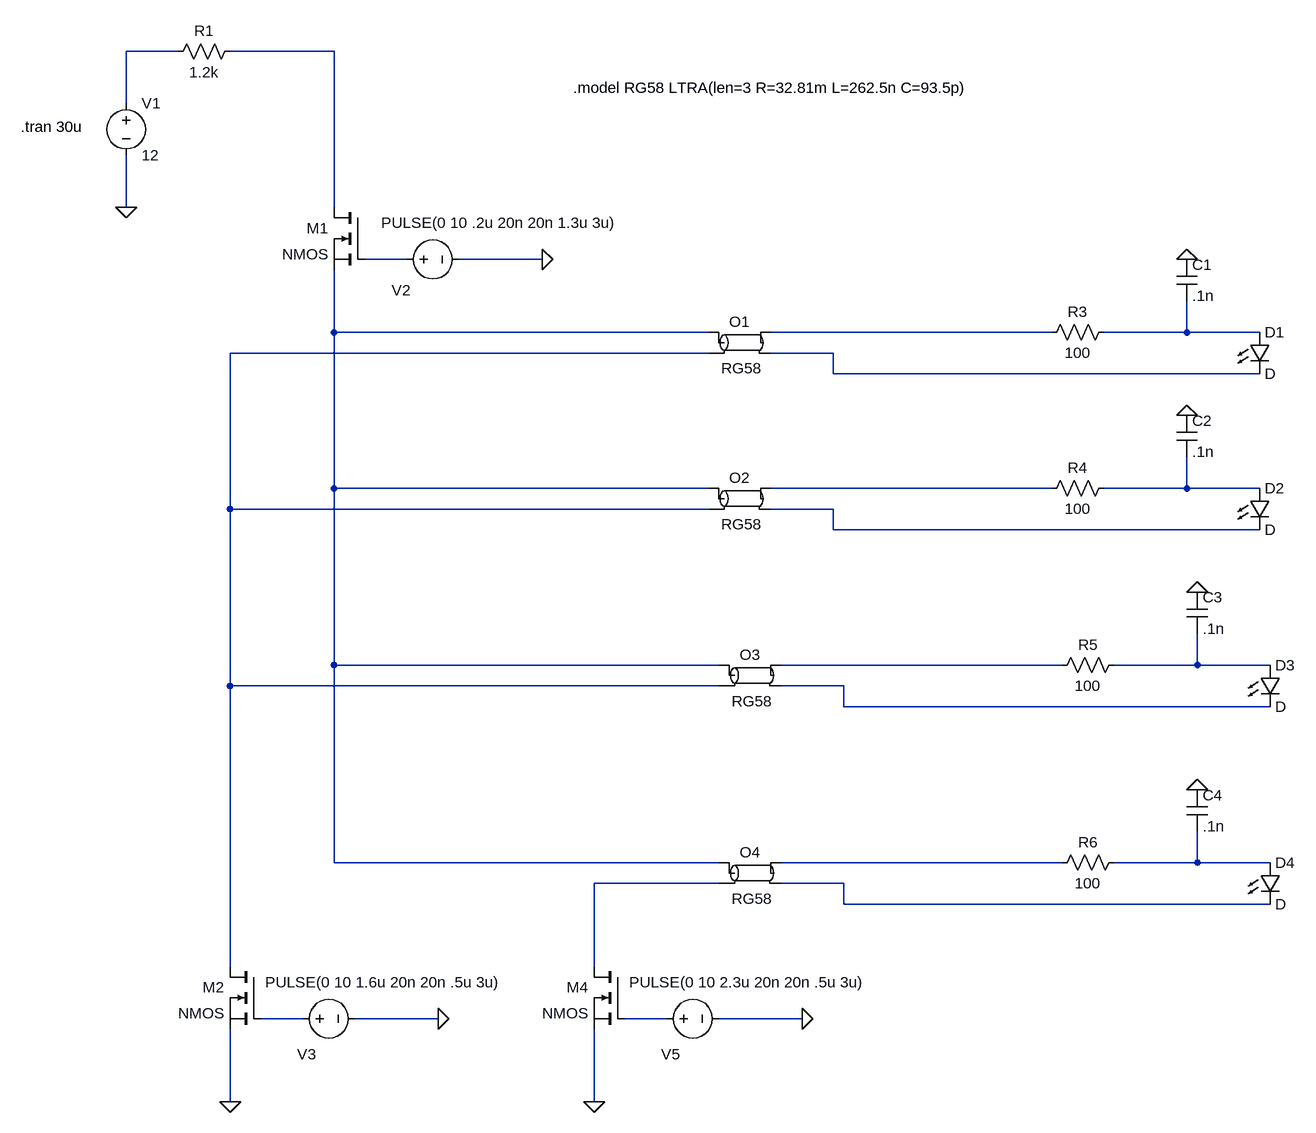
[diagram p0: schematic LEDpulser4_FULL_RG58.asc]
LEDpulser4_FULL_RG58.asc, the LTspice schematic file:
Version 4
SHEET 1 956 1444
WIRE -784 -288 -864 -288
WIRE -544 -288 -704 -288
WIRE -864 -208 -864 -288
WIRE -864 -48 -864 -128
WIRE -544 -48 -544 -288
WIRE -432 32 -496 32
WIRE -224 32 -352 32
WIRE -544 144 -544 48
WIRE 32 144 -544 144
WIRE 560 144 128 144
WIRE 768 144 768 96
WIRE 768 144 640 144
WIRE 880 144 768 144
WIRE 32 176 -704 176
WIRE 224 176 128 176
WIRE 224 208 224 176
WIRE 880 208 224 208
WIRE -544 384 -544 144
WIRE 32 384 -544 384
WIRE 560 384 128 384
WIRE 768 384 768 336
WIRE 768 384 640 384
WIRE 880 384 768 384
WIRE -704 416 -704 176
WIRE 32 416 -704 416
WIRE 224 416 128 416
WIRE 224 448 224 416
WIRE 880 448 224 448
WIRE -544 656 -544 384
WIRE 48 656 -544 656
WIRE 576 656 144 656
WIRE 784 656 784 608
WIRE 784 656 656 656
WIRE 896 656 784 656
WIRE -704 688 -704 416
WIRE 48 688 -704 688
WIRE 240 688 144 688
WIRE 240 720 240 688
WIRE 896 720 240 720
WIRE -544 960 -544 656
WIRE 48 960 -544 960
WIRE 576 960 144 960
WIRE 784 960 784 912
WIRE 784 960 656 960
WIRE 896 960 784 960
WIRE 48 992 -144 992
WIRE 240 992 144 992
WIRE 240 1024 240 992
WIRE 896 1024 240 1024
WIRE -704 1120 -704 688
WIRE -144 1120 -144 992
WIRE -592 1200 -656 1200
WIRE -384 1200 -512 1200
WIRE -32 1200 -96 1200
WIRE 176 1200 48 1200
WIRE -704 1328 -704 1216
WIRE -144 1328 -144 1216
FLAG -224 32 0
FLAG -864 -48 0
FLAG -384 1200 0
FLAG 768 32 0
FLAG -704 1328 0
FLAG 768 272 0
FLAG 784 544 0
FLAG 784 848 0
FLAG 176 1200 0
FLAG -144 1328 0
SYMBOL voltage -864 -224 R0
WINDOW 123 0 0 Left 0
WINDOW 39 0 0 Left 0
SYMATTR InstName V1
SYMATTR Value 12
SYMBOL voltage -448 32 R270
WINDOW 0 -63 7 VTop 2
WINDOW 3 72 159 VBottom 2
WINDOW 123 0 0 Left 0
WINDOW 39 0 0 Left 0
SYMATTR InstName V2
SYMATTR Value PULSE(0 10 .2u 20n 20n 1.3u 3u)
SYMBOL nmos -496 -48 M0
SYMATTR InstName M1
SYMBOL res -688 -304 R90
WINDOW 0 0 56 VBottom 2
WINDOW 3 32 56 VTop 2
SYMATTR InstName R1
SYMATTR Value 1.2k
SYMBOL nmos -656 1120 M0
SYMATTR InstName M2
SYMBOL voltage -608 1200 R270
WINDOW 0 -55 7 VRight 2
WINDOW 3 56 -42 VRight 2
WINDOW 123 0 0 Left 0
WINDOW 39 0 0 Left 0
SYMATTR InstName V3
SYMATTR Value PULSE(0 10 1.6u 20n 20n .5u 3u)
SYMBOL LED 864 144 R0
SYMATTR InstName D1
SYMBOL cap 752 32 R0
SYMATTR InstName C1
SYMATTR Value .1n
SYMBOL res 656 128 R90
WINDOW 0 0 56 VBottom 2
WINDOW 3 32 56 VTop 2
SYMATTR InstName R3
SYMATTR Value 100
SYMBOL ltline 80 160 R0
WINDOW 3 3 24 Top 2
SYMATTR Value RG58
SYMATTR InstName O1
SYMBOL LED 864 384 R0
SYMATTR InstName D2
SYMBOL cap 752 272 R0
SYMATTR InstName C2
SYMATTR Value .1n
SYMBOL res 656 368 R90
WINDOW 0 0 56 VBottom 2
WINDOW 3 32 56 VTop 2
SYMATTR InstName R4
SYMATTR Value 100
SYMBOL ltline 80 400 R0
WINDOW 3 3 24 Top 2
SYMATTR Value RG58
SYMATTR InstName O2
SYMBOL LED 880 656 R0
SYMATTR InstName D3
SYMBOL cap 768 544 R0
SYMATTR InstName C3
SYMATTR Value .1n
SYMBOL res 672 640 R90
WINDOW 0 0 56 VBottom 2
WINDOW 3 32 56 VTop 2
SYMATTR InstName R5
SYMATTR Value 100
SYMBOL ltline 96 672 R0
WINDOW 3 3 24 Top 2
SYMATTR Value RG58
SYMATTR InstName O3
SYMBOL LED 880 960 R0
SYMATTR InstName D4
SYMBOL cap 768 848 R0
SYMATTR InstName C4
SYMATTR Value .1n
SYMBOL res 672 944 R90
WINDOW 0 0 56 VBottom 2
WINDOW 3 32 56 VTop 2
SYMATTR InstName R6
SYMATTR Value 100
SYMBOL ltline 96 976 R0
WINDOW 3 3 24 Top 2
SYMATTR Value RG58
SYMATTR InstName O4
SYMBOL nmos -96 1120 M0
SYMATTR InstName M4
SYMBOL voltage -48 1200 R270
WINDOW 0 -55 7 VRight 2
WINDOW 3 56 -42 VRight 2
WINDOW 123 0 0 Left 0
WINDOW 39 0 0 Left 0
SYMATTR InstName V5
SYMATTR Value PULSE(0 10 2.3u 20n 20n .5u 3u)
TEXT -1026 -172 Left 2 !.tran 30u
TEXT -176 -232 Left 2 !.model RG58 LTRA(len=3 R=32.81m L=262.5n C=93.5p)

The netlist it stands for:
* LEDpulser4_FULL_RG58.asc
V1 N001 0 12
V2 N003 0 PULSE(0 10 .2u 20n 20n 1.3u 3u)
M1 N002 N003 N004 N004 NMOS
R1 N002 N001 1.2k
M2 N007 N019 0 0 NMOS
V3 N019 0 PULSE(0 10 1.6u 20n 20n .5u 3u)
D1 N006 N008 D
C1 0 N006 .1n
R3 N006 N005 100
O1 N004 N007 N005 N008 RG58
D2 N010 N011 D
C2 0 N010 .1n
R4 N010 N009 100
O2 N004 N007 N009 N011 RG58
D3 N013 N014 D
C3 0 N013 .1n
R5 N013 N012 100
O3 N004 N007 N012 N014 RG58
D4 N016 N018 D
C4 0 N016 .1n
R6 N016 N015 100
O4 N004 N017 N015 N018 RG58
M4 N017 N020 0 0 NMOS
V5 N020 0 PULSE(0 10 2.3u 20n 20n .5u 3u)
.model D D
.lib standard.dio
.model NMOS NMOS
.model PMOS PMOS
.lib standard.mos
.tran 30u
.model RG58 LTRA(len=3 R=32.81m L=262.5n C=93.5p)
.backanno
.end